# EAGLE schematic downlink_15 (EAGLE 7.2.0)
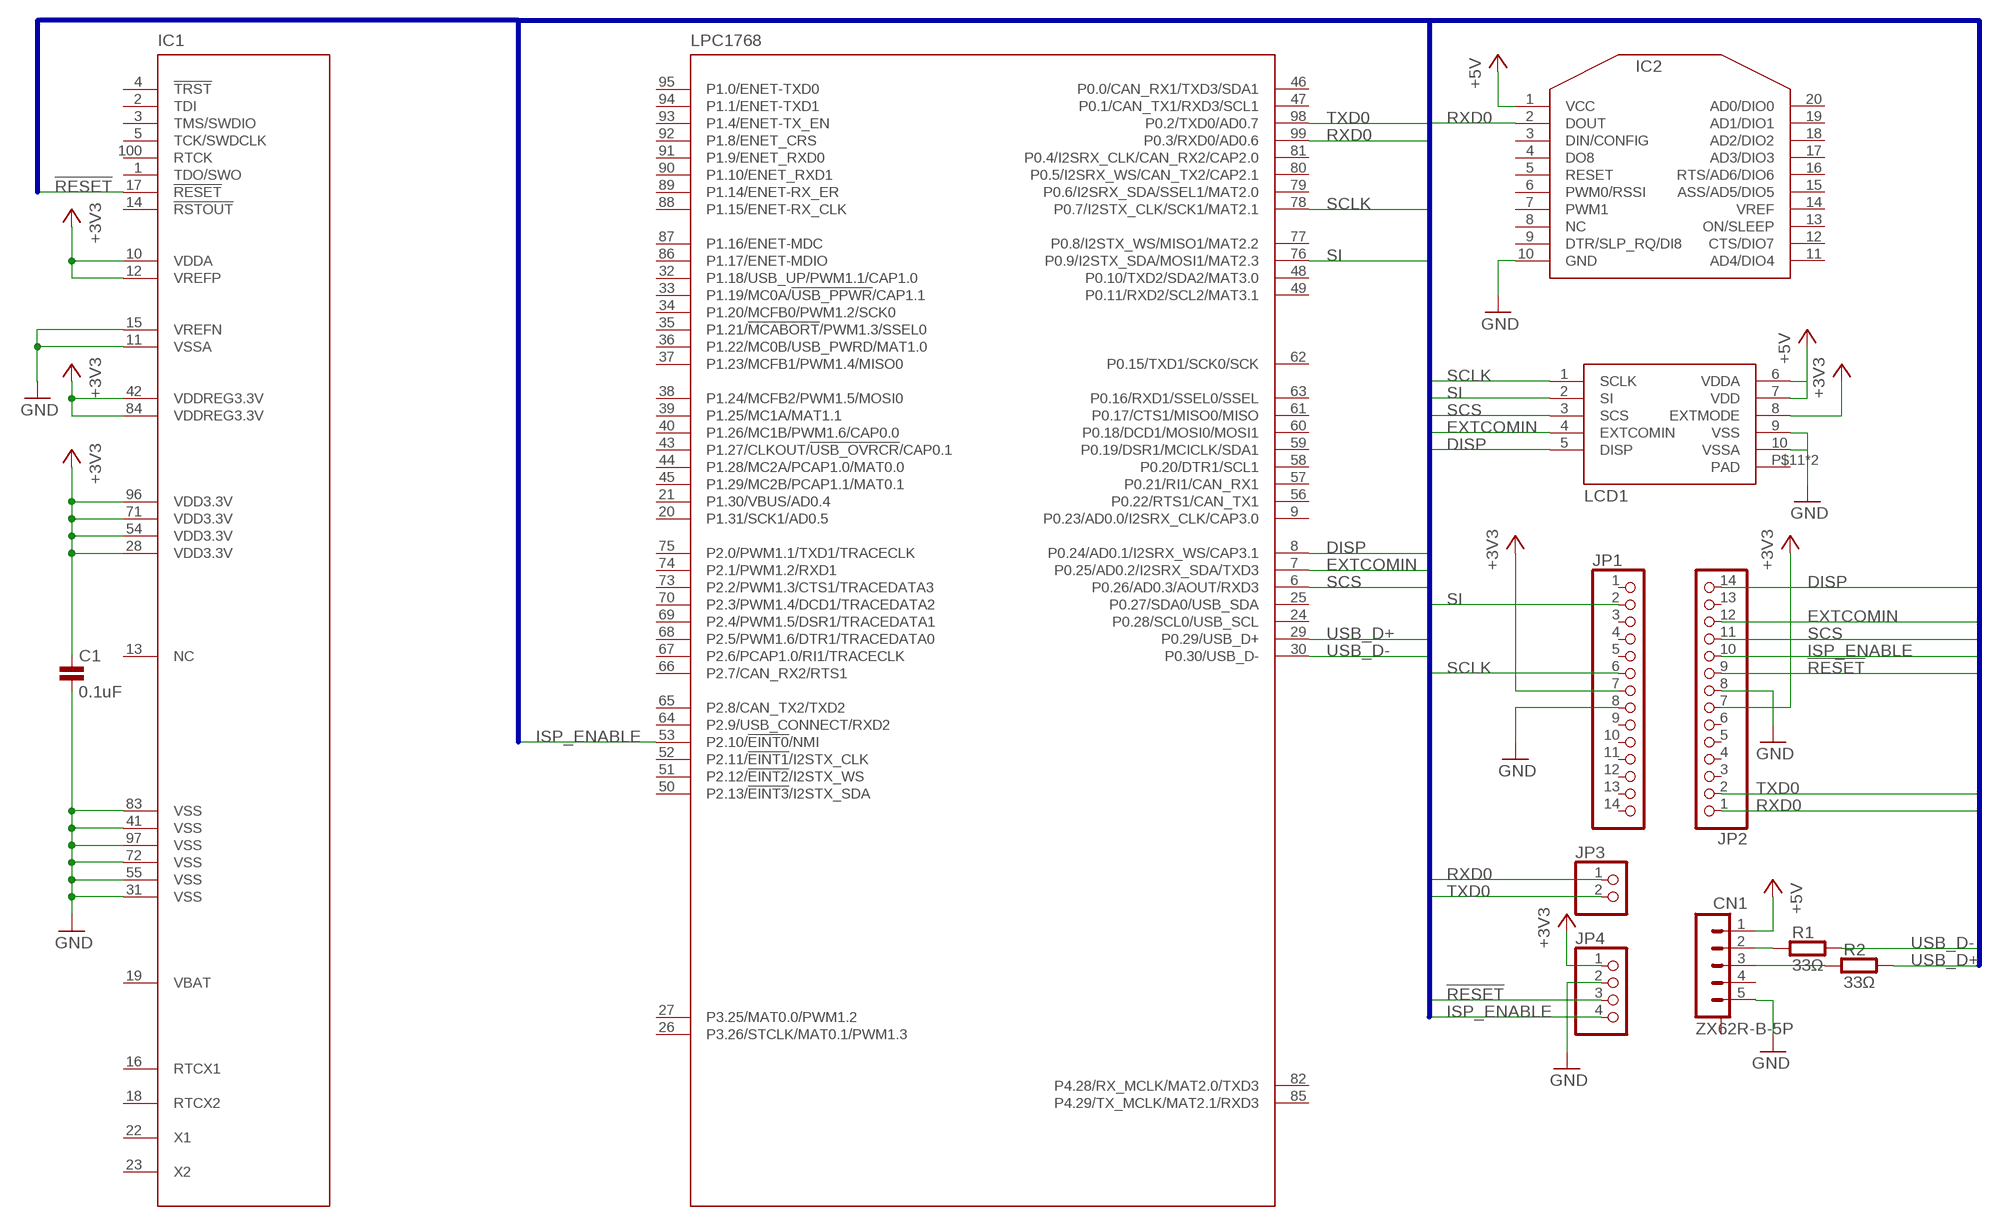
[diagram p0: schematic, sheet 1]

## Parts
C1  0.1uF  C0603  [0603]
CN1  ZX62R-B-5P  [MICRO-B]
IC1  LPC1768  [LQFP100]
IC2  XBEE-PRO2MM  [XBEE-ZB]
JP1  PINHD-1X14  [1X14]
JP2  PINHD-1X14  [1X14]
JP3  PINHD-1X2  [1X02]
JP4  PINHD-1X4  [1X04]
LCD1  LS027B4DH01SMD  [FH12-10S-0.5SH]
R1  33Ω  R0603  [0603]
R2  33Ω  R0603  [0603]

## Nets
!RESET!: IC1.17(!RESET!) JP2.9 JP4.3
+3V3: C1.1 IC1.10(VDDA) IC1.12(VREFP) IC1.28(VDD3.3V) IC1.42(VDDREG3.3V) IC1.54(VDD3.3V) IC1.71(VDD3.3V) IC1.84(VDDREG3.3V) IC1.96(VDD3.3V) JP1.7 JP2.7 JP4.1 LCD1.8(EXTMODE)
+5V: CN1.1(5.GND) IC2.1(VCC) LCD1.6(VDDA) LCD1.7(VDD)
DISP: IC1.8(P0.24/AD0.1/I2SRX_WS/CAP3.1) JP2.14 LCD1.5(DISP)
EXTCOMIN: IC1.7(P0.25/AD0.2/I2SRX_SDA/TXD3) JP2.12 LCD1.4(EXTCOMIN)
GND: C1.2 CN1.5(1.VBUS) IC1.11(VSSA) IC1.15(VREFN) IC1.31(VSS) IC1.41(VSS) IC1.55(VSS) IC1.72(VSS) IC1.83(VSS) IC1.97(VSS) IC2.10(GND) JP1.8 JP2.8 JP4.2 LCD1.9(VSS) LCD1.10(VSSA)
ISP_ENABLE: IC1.53(P2.10/!EINT0!/NMI) JP2.10 JP4.4
N$1: CN1.2(4.ID) R1.1
N$2: CN1.3(3.D+) R2.1
RXD0: IC1.99(P0.3/RXD0/AD0.6) IC2.2(DOUT) JP2.1 JP3.1
SCLK: IC1.78(P0.7/I2STX_CLK/SCK1/MAT2.1) JP1.6 LCD1.1(SCLK)
SCS: IC1.6(P0.26/AD0.3/AOUT/RXD3) JP2.11 LCD1.3(SCS)
SI: IC1.76(P0.9/I2STX_SDA/MOSI1/MAT2.3) JP1.2 LCD1.2(SI)
TXD0: IC1.98(P0.2/TXD0/AD0.7) JP2.2 JP3.2
USB_D+: IC1.29(P0.29/USB_D+) R2.2
USB_D-: IC1.30(P0.30/USB_D-) R1.2
Unconnected: CN1.4(2.D-) CN1.CASE@1 CN1.CASE@2 CN1.CASE@3 CN1.CASE@4 IC1.1(TDO/SWO) IC1.2(TDI) IC1.3(TMS/SWDIO) IC1.4(!TRST!) IC1.5(TCK/SWDCLK) IC1.9(P0.23/AD0.0/I2SRX_CLK/CAP3.0) IC1.13(NC) IC1.14(!RSTOUT!) IC1.16(RTCX1) IC1.18(RTCX2) IC1.19(VBAT) IC1.20(P1.31/SCK1/AD0.5) IC1.21(P1.30/VBUS/AD0.4) IC1.22(X1) IC1.23(X2) IC1.24(P0.28/SCL0/USB_SCL) IC1.25(P0.27/SDA0/USB_SDA) IC1.26(P3.26/STCLK/MAT0.1/PWM1.3) IC1.27(P3.25/MAT0.0/PWM1.2) IC1.32(P1.18/USB_UP/PWM1.1/CAP1.0) IC1.33(P1.19/MC0A/!USB_PPWR!/CAP1.1) IC1.34(P1.20/MCFB0/PWM1.2/SCK0) IC1.35(P1.21/!MCABORT!/PWM1.3/SSEL0) IC1.36(P1.22/MC0B/USB_PWRD/MAT1.0) IC1.37(P1.23/MCFB1/PWM1.4/MISO0) IC1.38(P1.24/MCFB2/PWM1.5/MOSI0) IC1.39(P1.25/MC1A/MAT1.1) IC1.40(P1.26/MC1B/PWM1.6/CAP0.0) IC1.43(P1.27/CLKOUT/!USB_OVRCR!/CAP0.1) IC1.44(P1.28/MC2A/PCAP1.0/MAT0.0) IC1.45(P1.29/MC2B/PCAP1.1/MAT0.1) IC1.46(P0.0/CAN_RX1/TXD3/SDA1) IC1.47(P0.1/CAN_TX1/RXD3/SCL1) IC1.48(P0.10/TXD2/SDA2/MAT3.0) IC1.49(P0.11/RXD2/SCL2/MAT3.1) IC1.50(P2.13/!EINT3!/I2STX_SDA) IC1.51(P2.12/!EINT2!/I2STX_WS) IC1.52(P2.11/!EINT1!/I2STX_CLK) IC1.56(P0.22/RTS1/CAN_TX1) IC1.57(P0.21/RI1/CAN_RX1) IC1.58(P0.20/DTR1/SCL1) IC1.59(P0.19/DSR1/MCICLK/SDA1) IC1.60(P0.18/DCD1/MOSI0/MOSI1) IC1.61(P0.17/CTS1/MISO0/MISO) IC1.62(P0.15/TXD1/SCK0/SCK) IC1.63(P0.16/RXD1/SSEL0/SSEL) IC1.64(P2.9/USB_CONNECT/RXD2) IC1.65(P2.8/CAN_TX2/TXD2) IC1.66(P2.7/CAN_RX2/RTS1) IC1.67(P2.6/PCAP1.0/RI1/TRACECLK) IC1.68(P2.5/PWM1.6/DTR1/TRACEDATA0) IC1.69(P2.4/PWM1.5/DSR1/TRACEDATA1) IC1.70(P2.3/PWM1.4/DCD1/TRACEDATA2) IC1.73(P2.2/PWM1.3/CTS1/TRACEDATA3) IC1.74(P2.1/PWM1.2/RXD1) IC1.75(P2.0/PWM1.1/TXD1/TRACECLK) IC1.77(P0.8/I2STX_WS/MISO1/MAT2.2) IC1.79(P0.6/I2SRX_SDA/SSEL1/MAT2.0) IC1.80(P0.5/I2SRX_WS/CAN_TX2/CAP2.1) IC1.81(P0.4/I2SRX_CLK/CAN_RX2/CAP2.0) IC1.82(P4.28/RX_MCLK/MAT2.0/TXD3) IC1.85(P4.29/TX_MCLK/MAT2.1/RXD3) IC1.86(P1.17/ENET-MDIO) IC1.87(P1.16/ENET-MDC) IC1.88(P1.15/ENET-RX_CLK) IC1.89(P1.14/ENET-RX_ER) IC1.90(P1.10/ENET_RXD1) IC1.91(P1.9/ENET_RXD0) IC1.92(P1.8/ENET_CRS) IC1.93(P1.4/ENET-TX_EN) IC1.94(P1.1/ENET-TXD1) IC1.95(P1.0/ENET-TXD0) IC1.100(RTCK) IC2.3(DIN/CONFIG) IC2.4(DO8) IC2.5(RESET) IC2.6(PWM0/RSSI) IC2.7(PWM1) IC2.8(NC) IC2.9(DTR/SLP_RQ/DI8) IC2.11(AD4/DIO4) IC2.12(CTS/DIO7) IC2.13(ON/SLEEP) IC2.14(VREF) IC2.15(ASS/AD5/DIO5) IC2.16(RTS/AD6/DIO6) IC2.17(AD3/DIO3) IC2.18(AD2/DIO2) IC2.19(AD1/DIO1) IC2.20(AD0/DIO0) JP1.1 JP1.3 JP1.4 JP1.5 JP1.9 JP1.10 JP1.11 JP1.12 JP1.13 JP1.14 JP2.3 JP2.4 JP2.5 JP2.6 JP2.13 LCD1.P$11(PAD) LCD1.P$12(PAD)

## Buses
SCLK,SI,SCS,EXTCOMIN,DISP,RXD0,TXD0,!RESET!,ISP_ENABLE,USB_D+,USB_D-

## Library data of the parts
C1 = untitled:C: CAPACITOR
CN1 = untitled:ZX62R-B-5P
IC1 = untitled:LPC1768
IC2 = untitled:XBEE-PRO: XBee
JP1 JP2 = pinhead:PINHD-1X14: PIN HEADER
JP3 = pinhead:PINHD-1X2: PIN HEADER
JP4 = pinhead:PINHD-1X4: PIN HEADER
LCD1 = untitled:LS027B4DH01: LCD
R1 R2 = untitled:R: RESISTOR